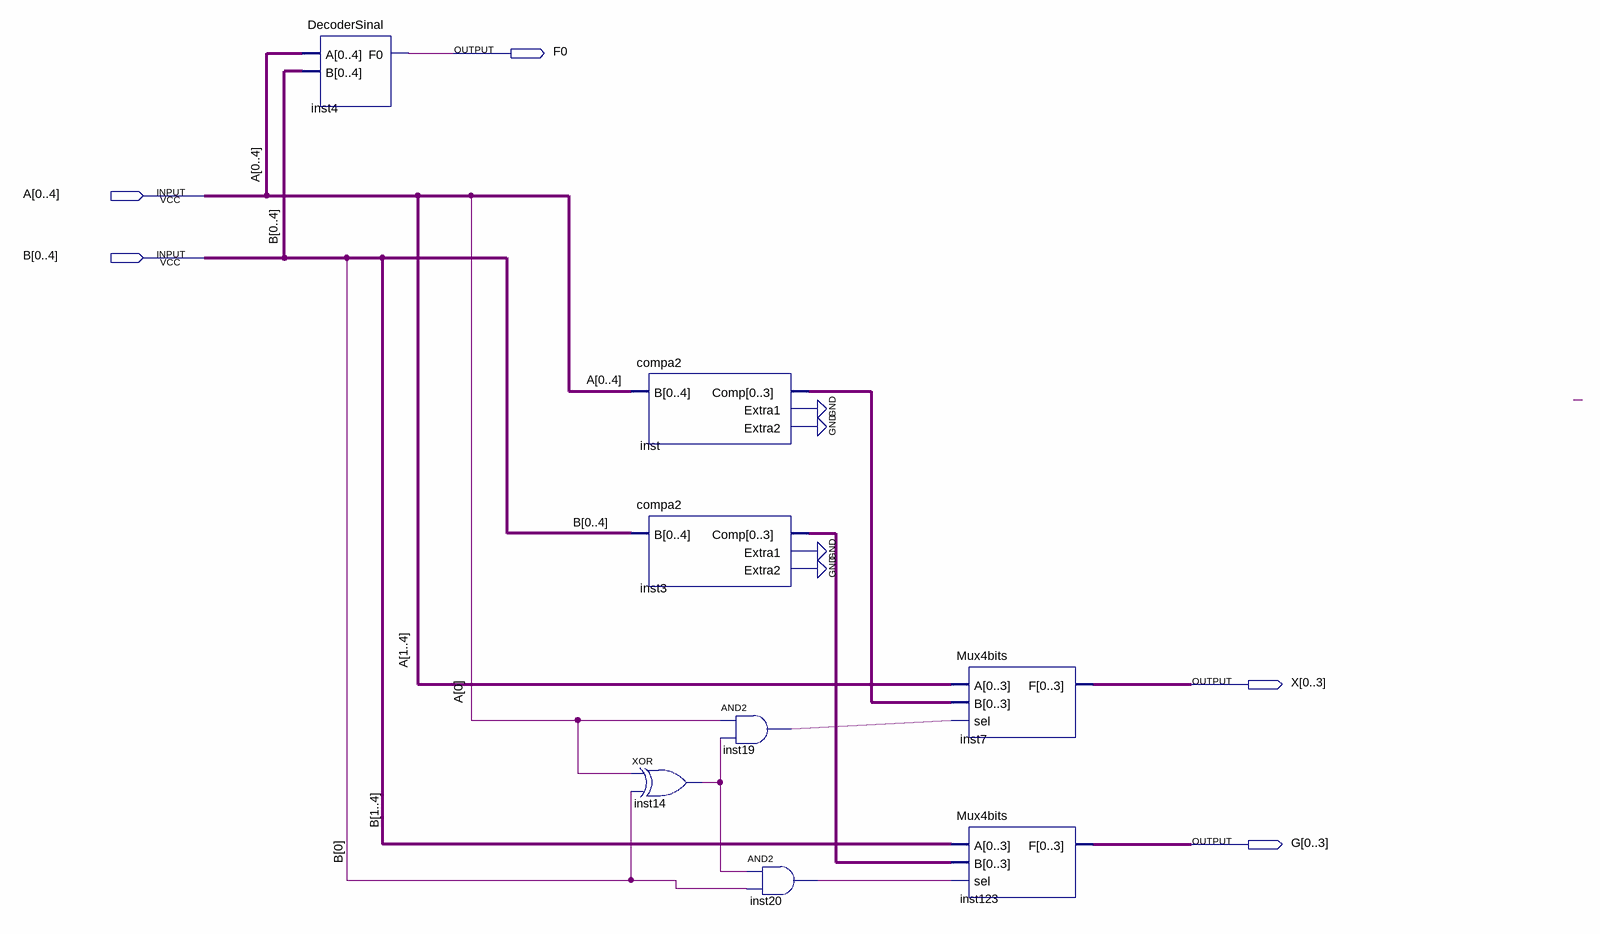
[diagram p0: schematic sheet]
// Quartus schematic teste2.bdf as structural Verilog: 8 symbols, 5 pins
module teste2 (
  input  [0:4] A,
  input  [0:4] B,
  output F0,
  output [0:3] X,
  output [0:3] G
);

  wire inst3_extra1, inst3_extra2, inst14_out, inst19_out, inst20_out, inst_extra1, inst_extra2;
  wire [3:0] inst3_comp, inst_comp;

  DecoderSinal inst4 (.A(A), .B(B), .F0(F0));
  compa2 inst (.B(A), .Comp(inst_comp), .Extra1(inst_extra1), .Extra2(inst_extra2));
  compa2 inst3 (.B(B), .Comp(inst3_comp), .Extra1(inst3_extra1), .Extra2(inst3_extra2));
  xor inst14 (inst14_out, A[0], B[0]);
  and inst19 (inst19_out, A[0], inst14_out);
  and inst20 (inst20_out, inst14_out, B[0]);
  Mux4bits inst7 (.A(A[1:4]), .B(inst_comp), .sel(inst19_out), .F(X));
  Mux4bits inst123 (.A(B[1:4]), .B(inst3_comp), .sel(inst20_out), .F(G));
  // also tied to GND on the sheet: {inst_extra1, inst_extra2, inst3_extra1, inst3_extra2}
endmodule
